# EAGLE design USB_Interlock_V3 (EAGLE 7.1.0)
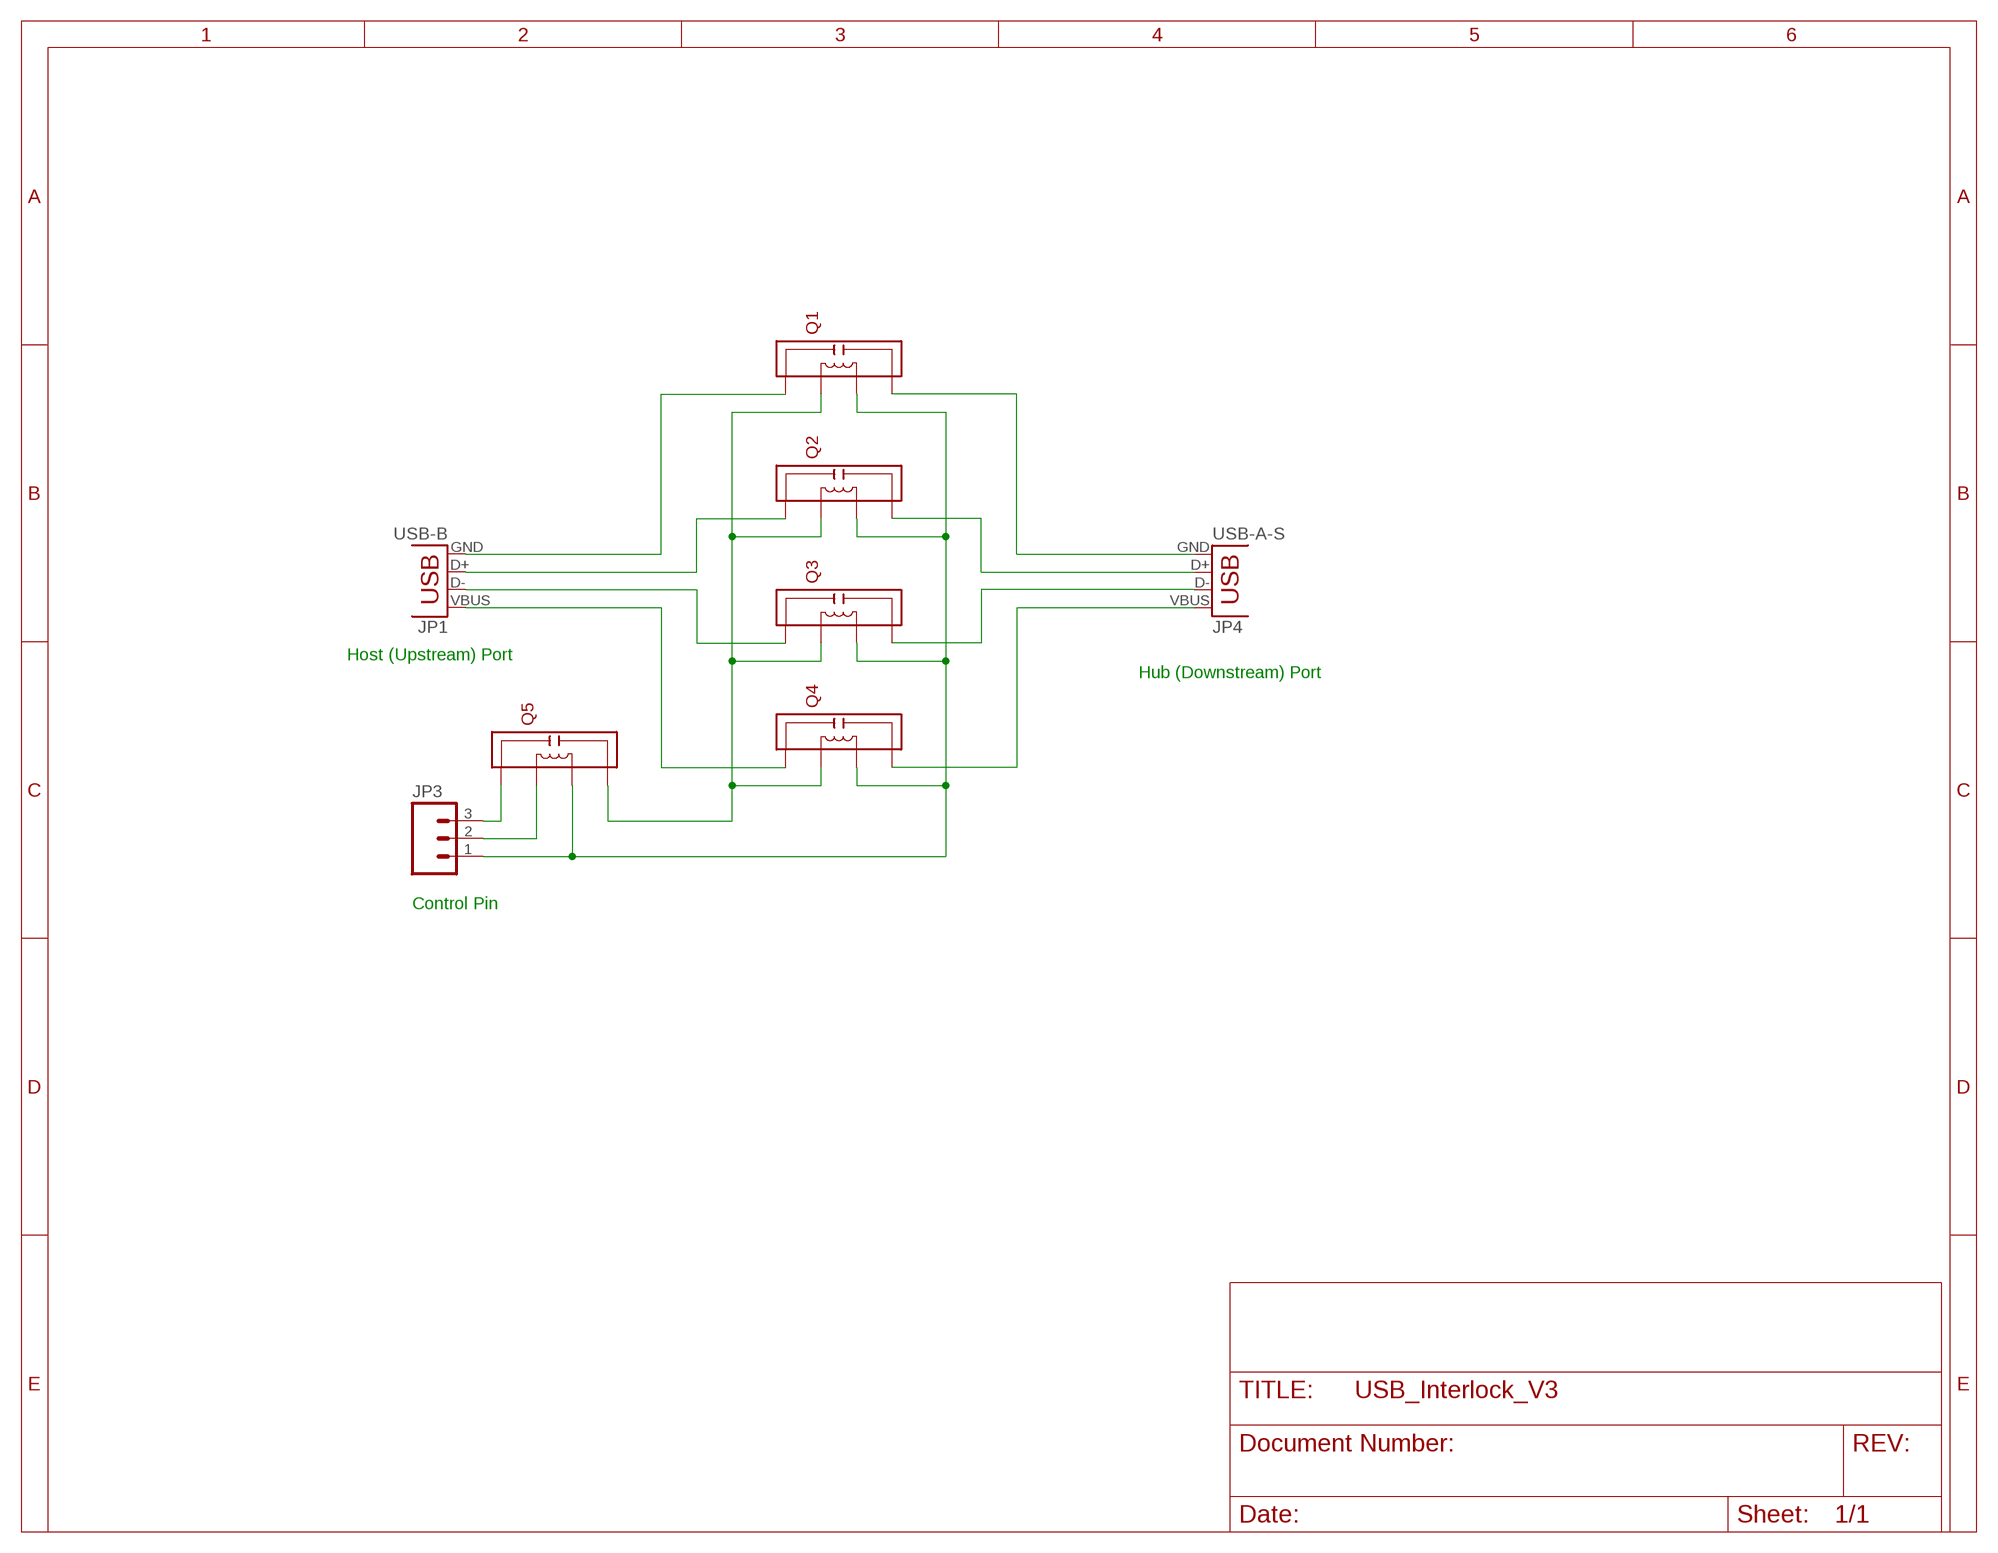
[diagram p0: schematic, sheet 1]

## Parts
JP1  USB-B  USBPTH  [USB-B-PTH]
JP3  M03LONGPADS  [1X03_LONGPADS]
JP4  USB-A-S  [USB-A-S]
Q1  9007-12-01  [9007-12-01]
Q2  9007-12-01  [9007-12-01]
Q3  9007-12-01  [9007-12-01]
Q4  9007-12-01  [9007-12-01]
Q5  9007-12-01  [9007-12-01]

## Nets
GND: JP3.1 Q1.P$3 Q2.P$3 Q3.P$3 Q4.P$3 Q5.P$3
HV1: JP4.D- Q3.P$4
HV2: JP4.D+ Q2.P$4
LV1: JP1.D- Q3.P$1
LV2: JP1.D+ Q2.P$1
N$1: JP3.3 Q5.P$1
N$2: JP3.2 Q5.P$2
N$3: Q1.P$2 Q2.P$2 Q3.P$2 Q4.P$2 Q5.P$4
N$4: JP1.GND Q1.P$1
N$6: JP4.GND Q1.P$4
N$9: JP1.VBUS Q4.P$1
V1: JP4.VBUS Q4.P$4

## Notes on the sheet
- Host (Upstream) Port
- Hub (Downstream) Port
- Control Pin

## Library data of the parts
JP1 = SparkFun-Connectors:USB: USB Connectors USB-B-PTH is fully proven SKU : PRT-00139/CONN-08278 USB-miniB is fully proven SKU : PRT-00587 USB-A-PCB is untested. USB-A-H is throughly reviewed, but untested. Spark Fun Electronics SKU : PRT-00437 USB-B-SMT is throughly reviewed, but untested. Needs silkscreen touching up. USB-A-S has not been used/tested USB-MB-H has not been used/tested USB-MICROB has been used. CONN-09505; PROD_ID: CONN-08278
JP3 = SparkFun-Connectors:M03: Header 3 Standard 3-pin 0.1" header. Use with straight break away headers (SKU : PRT-00116), right angle break away headers (PRT-00553), swiss pins (PRT-00743), machine pins (PRT-00117), and female headers (PRT-00115). Molex polarized connector foot print use with SKU : PRT-08232 with associated crimp pins and housings.
JP4 = SparkFun-Connectors:USB: USB Connectors USB-B-PTH is fully proven SKU : PRT-00139/CONN-08278 USB-miniB is fully proven SKU : PRT-00587 USB-A-PCB is untested. USB-A-H is throughly reviewed, but untested. Spark Fun Electronics SKU : PRT-00437 USB-B-SMT is throughly reviewed, but untested. Needs silkscreen touching up. USB-A-S has not been used/tested USB-MB-H has not been used/tested USB-MICROB has been used. CONN-09505
Q1-Q5 = BOC_Custom:9007-12-01: Economy SIP Reed Relay - http://media.digikey.com/pdf/Data%20Sheets/Coto%20Technology%20PDFS/9000_Spartan_Series.pdf

## Board
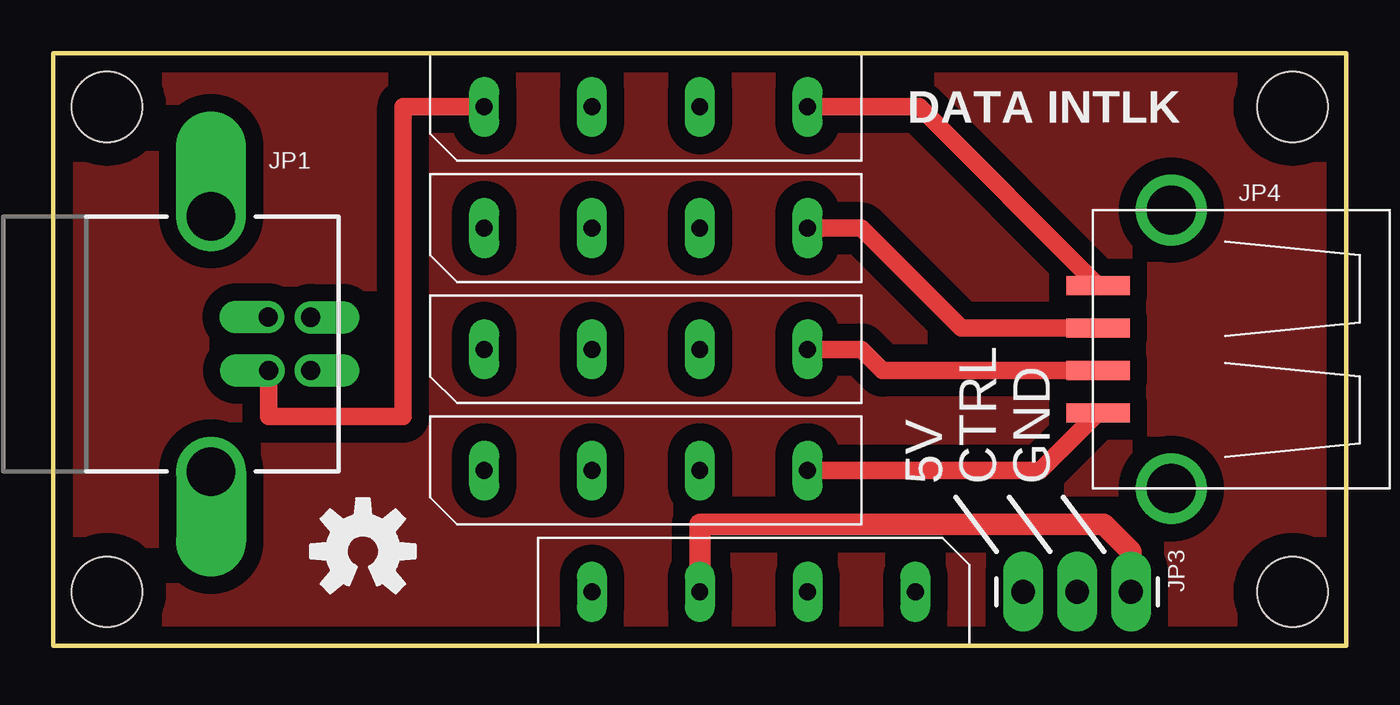
[diagram p1: board, top side]
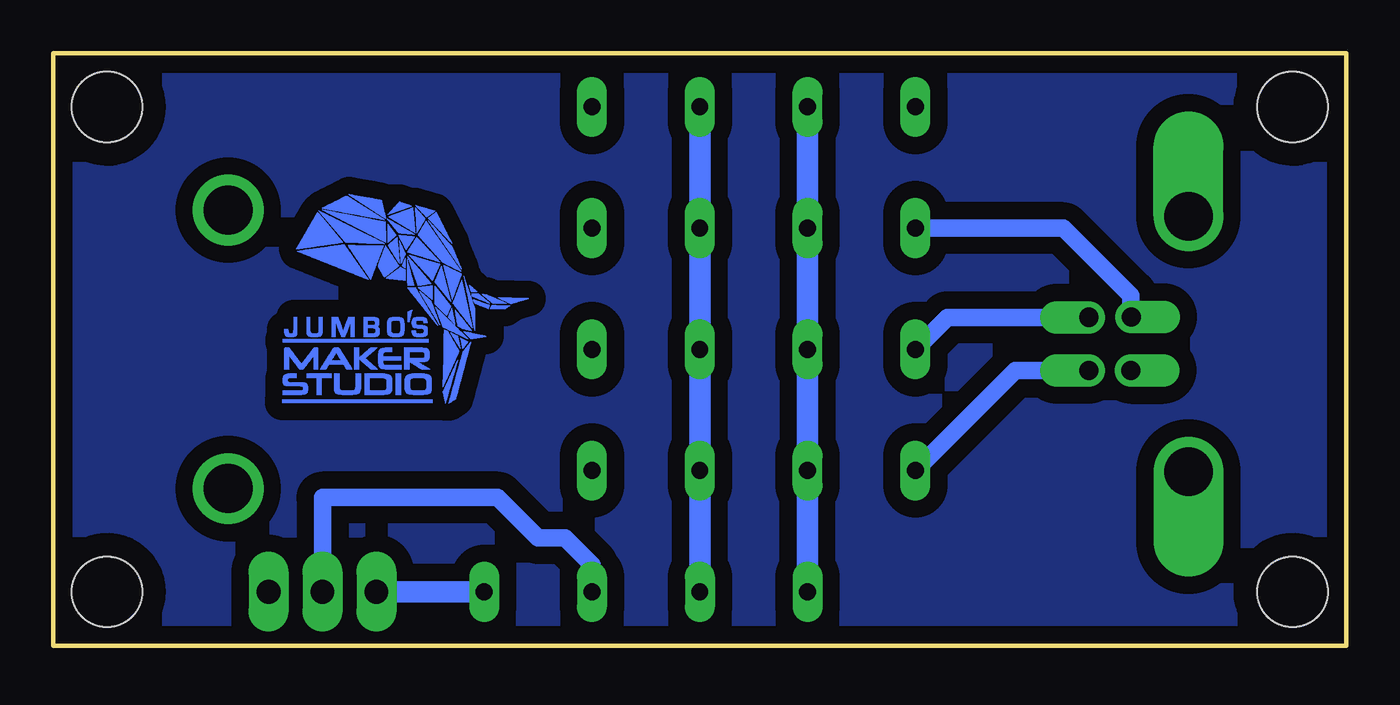
[diagram p2: board, bottom side, seen from below]

Size 60.96 x 27.94 mm. Coordinates in mm from the lower left corner, seen from the top.
Outline: 0,0 60.96,0 60.96,27.94 0,27.94 0,0
Copper layers (1*16): Top 0.035mm / dielectric 1.5mm / Bottom 0.035mm
Design rules "SparkFun *": minimum track width 24mil, minimum drill 20mil, track to track 18mil, track to pad 18mil, pad to pad 18mil, via to via 18mil, smd to smd 18mil, copper to edge 8mil, drill to drill 8mil, minimum pad ring 12mil, minimum via ring 10mil, stop-mask expansion 4mil, vias tented up to drill 20mil, thermal gap 16mil

### Footprints (pad centres in the part's own frame; a part is rotated, then mirrored left to right if it is on the bottom)
USB-B-PTH = drill 0.914 pad 1.422 offset: D+ -0.02,1.27; D- 1.981,1.25; GND 0,-1.25; VBUS 1.981,-1.25 | drill 2.286 offset: S1 -2.718,-6.02; S2 -2.718,6.02
1X03_LONGPADS = drill 1.118 pad 1.88 long: 1 0,0; 2 2.54,0; 3 5.08,0
USB-A-S = smd 3 x 0.9: D+ 3.45,-1; D- 3.45,1; GND 3.45,-3; VBUS 3.45,3 | drill 2.311: P$5 0,-6.566; P$6 0,6.566
9007-12-01 = drill 0.8 pad 1.422 long: P$1 2.54,17.78; P$2 2.54,12.7; P$3 2.54,7.62; P$4 2.54,2.54
STAND-OFF = hole 3.302: 0,0

### Placement (x,y rotation side)
JP1  10.16,14.22 0 top
JP3  50.8,2.54 180 top
JP4  52.7,13.97 180 top
Q1  38.1,22.86 90 top
Q2  38.1,17.14 90 top
Q3  38.1,11.43 90 top
Q4  38.1,5.71 90 top
Q5  22.86,5.08 270 top
U$1  [OSHW-LOGO-M]  14.61,4.45 0 top
U$2  [STAND-OFF]  2.54,2.54 0 top
U$3  [STAND-OFF]  2.54,25.4 0 top
U$4  [STAND-OFF]  58.42,25.4 0 top
U$5  [STAND-OFF]  58.42,2.54 0 top
U$7  [JMS_LOG_COPPER]  50.16,11.43 0 bottom

### Tracks (layer width: path | path; a pad name or v marks a point on that pad's centre or on a via)
GND
  Top 1.016: Q5.P$3 30.48,5.71 49.53,5.71 50.8,4.45 JP3.1
  Bottom 1.016: Q1.P$3 Q2.P$3 Q3.P$3 Q4.P$3 Q5.P$3
HV1
  Top 0.813: Q3.P$4 38.1,13.97 39.1,12.97 JP4.D-
HV2
  Top 0.813: JP4.D+ 42.81,14.97 38.1,19.68 Q2.P$4
LV1
  Bottom 0.813: JP1.D- 18.82,15.47 Q3.P$1
LV2
  Bottom 0.813: JP1.D+ 10.16,15.51 10.16,16.51 13.34,19.68 Q2.P$1
N$1
  Bottom 1.016: Q5.P$1 JP3.3
N$2
  Bottom 0.813: Q5.P$2 35.56,3.81 36.83,5.08 38.1,5.08 40.01,6.99 48.26,6.99 JP3.2
N$3
  Bottom 1.016: Q1.P$2 Q2.P$2 Q3.P$2 Q4.P$2 Q5.P$4
N$4
  Top 0.813: JP1.GND 10.16,10.79 16.51,10.79 16.51,25.4 Q1.P$1
N$5
  pour Top (isolate 0.813): 0,-0.64 60.96,-0.64 60.96,28.57 0,28.57
N$6
  Top 0.813: Q1.P$4 40.83,25.4 JP4.GND
N$7
  pour Bottom (isolate 0.813): 61.59,-0.64 -0.64,-0.64 -0.64,27.94 61.59,27.94
N$9
  Bottom 0.813: Q4.P$1 15.6,12.97 JP1.VBUS
V1
  Top 0.813: Q4.P$4 46.54,8.26 JP4.VBUS

### Text on the board
tPlace: DATA INTLK
tNames: 5V | CTRL | GND